# EAGLE design fdc (EAGLE 6.6.0)
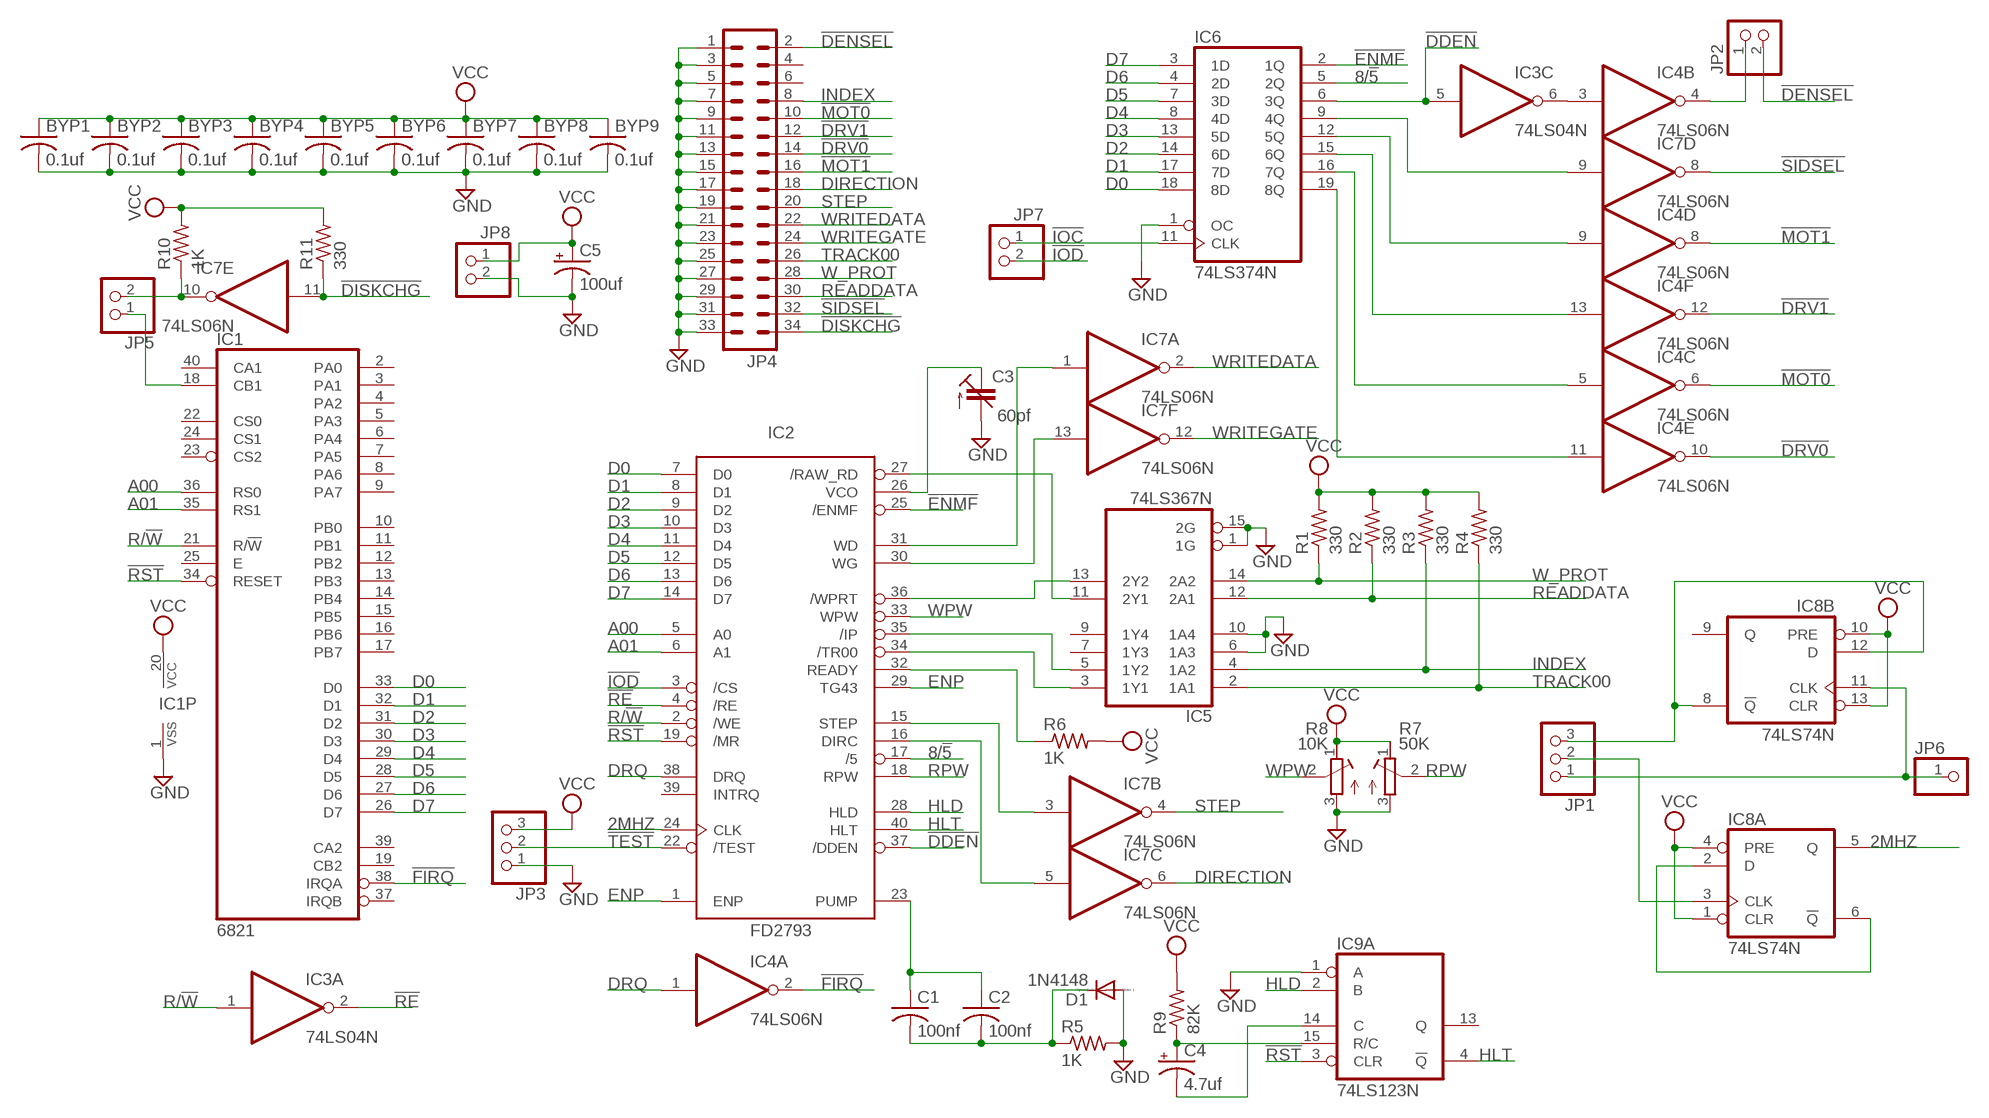
[diagram p0: schematic, sheet 1]

## Parts
BYP1  0.1uf  C-US050-025X075  [C050-025X075]
BYP2  0.1uf  C-US050-025X075  [C050-025X075]
BYP3  0.1uf  C-US050-025X075  [C050-025X075]
BYP4  0.1uf  C-US050-025X075  [C050-025X075]
BYP5  0.1uf  C-US050-025X075  [C050-025X075]
BYP6  0.1uf  C-US050-025X075  [C050-025X075]
BYP7  0.1uf  C-US050-025X075  [C050-025X075]
BYP8  0.1uf  C-US050-025X075  [C050-025X075]
BYP9  0.1uf  C-US050-025X075  [C050-025X075]
C1  100nf  C-US050-025X075  [C050-025X075]
C2  100nf  C-US050-025X075  [C050-025X075]
C3  60pf  C-TRIMM808  [CTRIM808-BC]
C4  4.7uf  CPOL-USE15-5AXIAL  [E15-5]
C5  100uf  CPOL-USE15-5AXIAL  [E15-5]
D1  1N4148  1N4148DO35-10  [DO35-10]
IC1  6821  [DIL40]
IC2  FD2793  [DIL40]
IC3  74LS04N  [DIL14]
IC4  74LS06N  [DIL14]
IC5  74LS367N  74367N  [DIL16]
IC6  74LS374N  [DIL20]
IC7  74LS06N  [DIL14]
IC8  74LS74N  [DIL14]
IC9  74LS123N  [DIL16]
JP1  PINHD-1X3  [1X03]
JP2  PINHD-1X2  [1X02]
JP3  PINHD-1X3  [1X03]
JP4  MA17-2  [MA17-2]
JP5  PINHD-1X2  [1X02]
JP6  PINHD-1X1  [1X01]
JP7  PINHD-1X2  [1X02]
JP8  PINHD-1X2  [1X02]
R1  330  R-US_0207/10  [0207/10]
R2  330  R-US_0207/10  [0207/10]
R3  330  R-US_0207/10  [0207/10]
R4  330  R-US_0207/10  [0207/10]
R5  1K  R-US_0207/10  [0207/10]
R6  1K  R-US_0207/10  [0207/10]
R7  50K  R-TRIMM43P  [RTRIM43P]
R8  10K  R-TRIMM43P  [RTRIM43P]
R9  82K  R-US_0207/10  [0207/10]
R10  1K  R-US_0207/10  [0207/10]
R11  330  R-US_0207/10  [0207/10]

## Nets
2MHZ: IC2.24(CLK) IC8.5(A:Q)
8/!5: IC2.17(/5) IC6.5(2Q)
!DDEN: IC2.37(/DDEN) IC3.5(C:I) IC6.6(3Q)
!DENSEL: JP2.2 JP4.2
!DISKCHG: IC7.11(E:I) JP4.34 R11.1
!DRV0: IC4.10(E:O) JP4.14
!DRV1: IC4.12(F:O) JP4.12
!ENMF: IC2.25(/ENMF) IC6.2(1Q)
!FIRQ: IC1.38(IRQA) IC4.2(A:O)
!IOC: IC6.11(CLK) JP7.1
!IOD: IC2.3(/CS) JP7.2
!MOT0: IC4.6(C:O) JP4.10
!MOT1: IC4.8(D:O) JP4.16
!RE: IC2.4(/RE) IC3.2(A:O)
!RST: IC1.34(RESET) IC2.19(/MR) IC9.3(A:CLR)
!SIDSEL: IC7.8(D:O) JP4.32
!TEST: IC2.22(/TEST) JP3.2
A00: IC1.36(RS0) IC2.5(A0)
A01: IC1.35(RS1) IC2.6(A1)
CB1: IC1.18(CB1) JP5.1
D0: IC1.33(D0) IC2.7(D0) IC6.18(8D)
D1: IC1.32(D1) IC2.8(D1) IC6.17(7D)
D2: IC1.31(D2) IC2.9(D2) IC6.14(6D)
D3: IC1.30(D3) IC2.10(D3) IC6.13(5D)
D4: IC1.29(D4) IC2.11(D4) IC6.8(4D)
D5: IC1.28(D5) IC2.12(D5) IC6.7(3D)
D6: IC1.27(D6) IC2.13(D6) IC6.4(2D)
D7: IC1.26(D7) IC2.14(D7) IC6.3(1D)
DIRECTION: IC7.6(C:O) JP4.18
DRQ: IC2.38(DRQ) IC4.1(A:I)
ENP: IC2.1(ENP) IC2.29(TG43)
GND: BYP1.2 BYP2.2 BYP3.2 BYP4.2 BYP5.2 BYP6.2 BYP7.2 BYP8.2 BYP9.2 C3.2(A) C5.- D1.A IC1.1(VSS) IC5.1(1G) IC5.6(1A3) IC5.10(1A4) IC5.15(2G) IC6.1(OC) IC9.1(A:A) JP3.1 JP4.1 JP4.3 JP4.5 JP4.7 JP4.9 JP4.11 JP4.13 JP4.15 JP4.17 JP4.19 JP4.21 JP4.23 JP4.25 JP4.27 JP4.29 JP4.31 JP4.33 JP8.2 R5.2 R7.3(A) R8.3(A)
HLD: IC2.28(HLD) IC9.2(A:B)
HLT: IC2.40(HLT) IC9.4(A:!Q)
INDEX: IC5.4(1A2) JP4.8 R3.1
N$1: IC3.6(C:O) IC4.3(B:I)
N$2: IC4.4(B:O) JP2.1
N$3: IC2.27(/RAW_RD) IC5.11(2Y1)
N$4: IC4.11(E:I) IC6.19(8Q)
N$5: IC4.5(C:I) IC6.16(7Q)
N$6: IC4.13(F:I) IC6.15(6Q)
N$7: IC4.9(D:I) IC6.12(5Q)
N$8: C4.+ IC9.15(A:R/C) R9.1
N$9: C4.- IC9.14(A:C)
N$10: IC2.32(READY) R6.1
N$11: IC6.9(4Q) IC7.9(D:I)
N$12: IC2.16(DIRC) IC7.5(C:I)
N$13: IC7.10(E:O) JP5.2 R10.1
N$14: IC2.34(/TR00) IC5.3(1Y1)
N$15: IC2.35(/IP) IC5.5(1Y2)
N$16: IC8.8(B:!Q) IC8.12(B:D) JP1.3
N$17: IC2.36(/WPRT) IC5.13(2Y2)
N$18: IC8.11(B:CLK) JP1.1 JP6.1
N$19: C3.1(E) IC2.26(VCO)
N$20: C1.2 C2.2 D1.C R5.1
N$21: IC2.31(WD) IC7.1(A:I)
N$22: IC2.30(WG) IC7.13(F:I)
N$24: IC2.15(STEP) IC7.3(B:I)
N$25: IC8.3(A:CLK) JP1.2
N$26: IC8.2(A:D) IC8.6(A:!Q)
PUMP: C1.1 C2.1 IC2.23(PUMP)
R/!W: IC1.21(R/!W) IC2.2(/WE) IC3.1(A:I)
READDATA: IC5.12(2A1) JP4.30 R2.1
RPW: IC2.18(RPW) R7.2(S)
STEP: IC7.4(B:O) JP4.20
TRACK00: IC5.2(1A1) JP4.26 R4.1
VCC [Power]: BYP1.1 BYP2.1 BYP3.1 BYP4.1 BYP5.1 BYP6.1 BYP7.1 BYP8.1 BYP9.1 C5.+ IC1.20(VCC) IC8.1(A:CLR) IC8.4(A:PRE) IC8.10(B:PRE) IC8.13(B:CLR) JP3.3 JP8.1 R1.2 R2.2 R3.2 R4.2 R6.2 R7.1(E) R8.1(E) R9.2 R10.2 R11.2
W_PROT: IC5.14(2A2) JP4.28 R1.1
WPW: IC2.33(WPW) R8.2(S)
WRITEDATA: IC7.2(A:O) JP4.22
WRITEGATE: IC7.12(F:O) JP4.24
Unconnected: IC1.2(PA0) IC1.3(PA1) IC1.4(PA2) IC1.5(PA3) IC1.6(PA4) IC1.7(PA5) IC1.8(PA6) IC1.9(PA7) IC1.10(PB0) IC1.11(PB1) IC1.12(PB2) IC1.13(PB3) IC1.14(PB4) IC1.15(PB5) IC1.16(PB6) IC1.17(PB7) IC1.19(CB2) IC1.22(CS0) IC1.23(CS2) IC1.24(CS1) IC1.25(E) IC1.37(IRQB) IC1.39(CA2) IC1.40(CA1) IC2.39(INTRQ) IC3.3(B:I) IC3.4(B:O) IC3.8(D:O) IC3.9(D:I) IC3.10(E:O) IC3.11(E:I) IC3.12(F:O) IC3.13(F:I) IC5.7(1Y3) IC5.9(1Y4) IC8.9(B:Q) IC9.5(B:Q) IC9.6(B:C) IC9.7(B:R/C) IC9.9(B:A) IC9.10(B:B) IC9.11(B:CLR) IC9.12(B:!Q) IC9.13(A:Q) JP4.4 JP4.6

## Power pins joined to a net without a drawn wire
GND: IC2.20(GND) IC3.7(P:GND) IC4.7(P:GND) IC5.8(GND) IC6.10(GND) IC7.7(P:GND) IC8.7(P:GND) IC9.8(P:GND)
VCC: IC2.21(VCC) IC3.14(P:VCC) IC4.14(P:VCC) IC5.16(VCC) IC6.20(VCC) IC7.14(P:VCC) IC8.14(P:VCC) IC9.16(P:VCC)

## Library data of the parts
BYP1-BYP9 C1 C2 = rcl:C-US: CAPACITOR, American symbol
C3 = rcl:C-TRIMM: Trimm capacitor
C4 C5 = rcl:CPOL-US: POLARIZED CAPACITOR, American symbol
D1 = diode:1N4148: DIODE high speed (Philips)
IC1 = micro-motorola:6821: MICROCONTROLLER/MEMORY DEVICE; MF: NTE ELECTRONICS; MPN: NTE6821; OC_FARNELL: 1652403; OC_NEWARK: 29C4772
IC2 = western-digital-devices:FD2793: FD2793 Floppy Disk Formatter/Controller
IC3 = 74xx-us:74*04: Hex INVERTER
IC4 IC7 = 74xx-us:74*06: Hex INVERTER, open collector high-voltage output
IC5 = 74xx-us:74*367: Hex BUS DRIVER, 3-state
IC6 = 74xx-us:74*374: Octal D type transparent LATCH, edge triggered
IC8 = 74xx-us:74*74: Dual D type positive edge triggered FLIP FLOP, preset and clear
IC9 = 74xx-us:74*123: Retriggerable monostable MULTIVIBRATOR
JP1 JP3 = pinhead:PINHD-1X3: PIN HEADER
JP2 JP5 JP7 JP8 = pinhead:PINHD-1X2: PIN HEADER
JP4 = con-lstb:MA17-2: PIN HEADER; OC_FARNELL: unknown; OC_NEWARK: unknown
JP6 = pinhead:PINHD-1X1: PIN HEADER
R1-R6 R9-R11 = rcl:R-US_: RESISTOR, American symbol
R7 R8 = rcl:R-TRIMM: Trimm resistor

## Net classes
1 Power: width 0.508 mm, drill 0.254 mm, clearance 0.254 mm

## Board
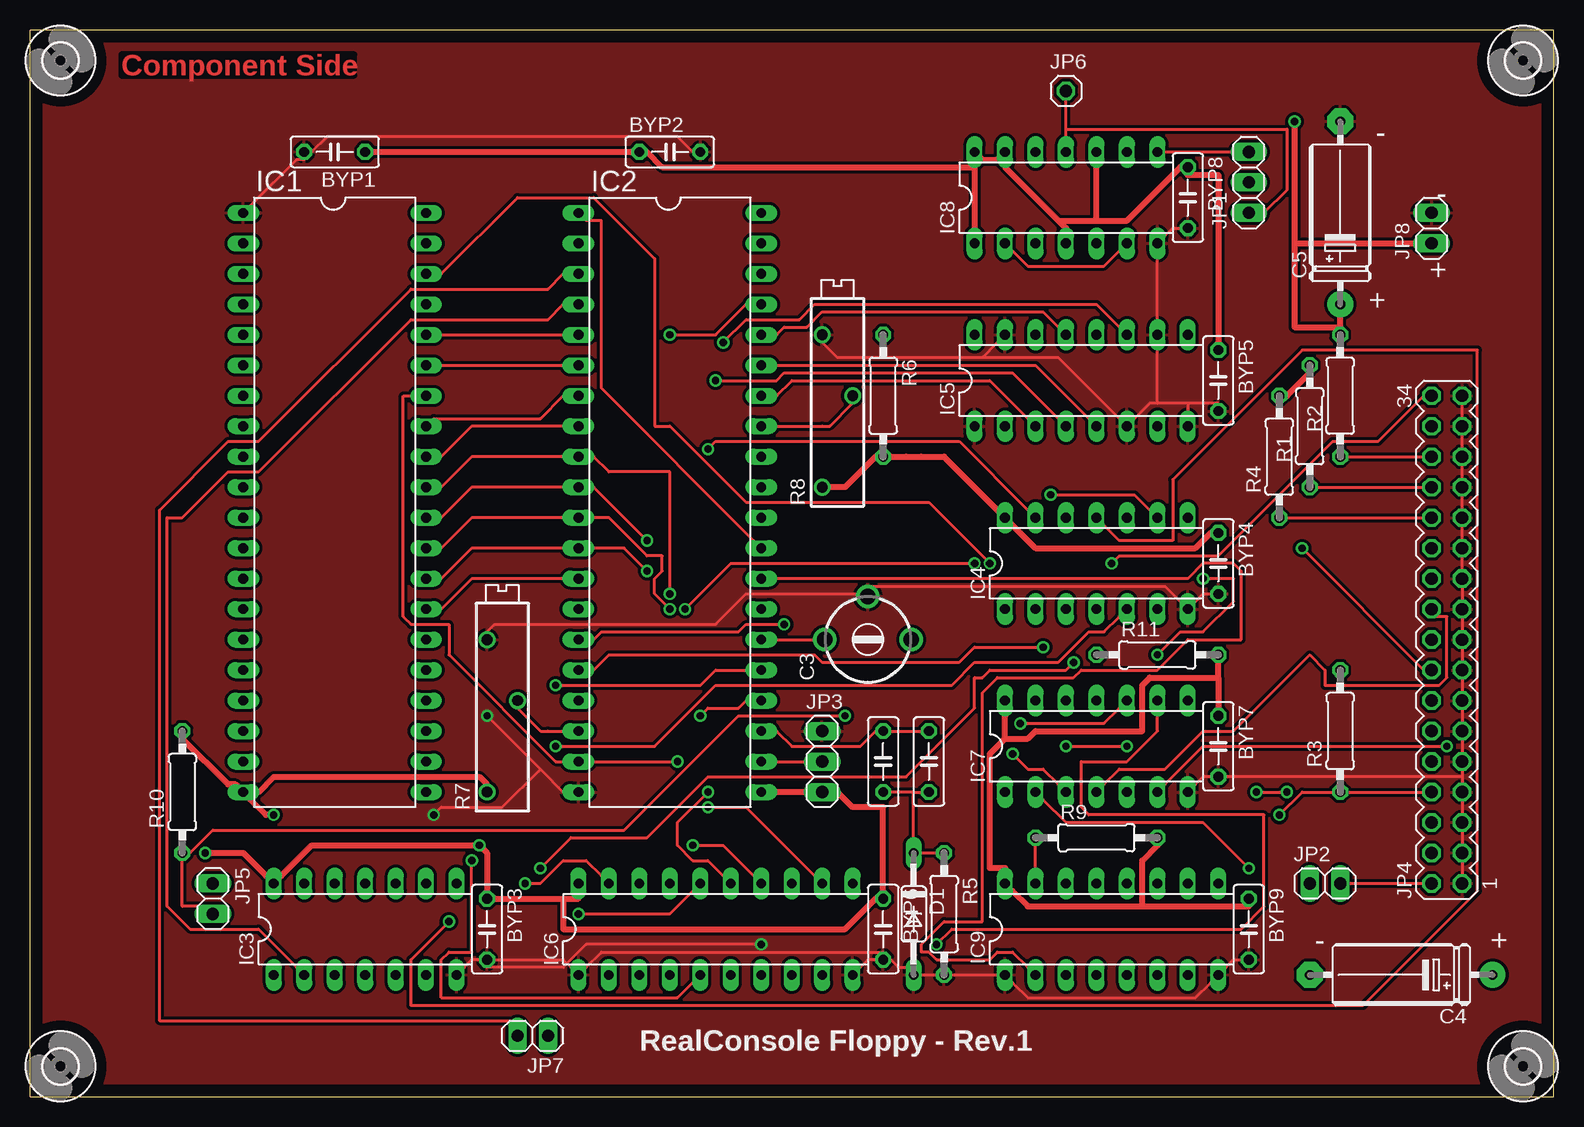
[diagram p1: board, top side]
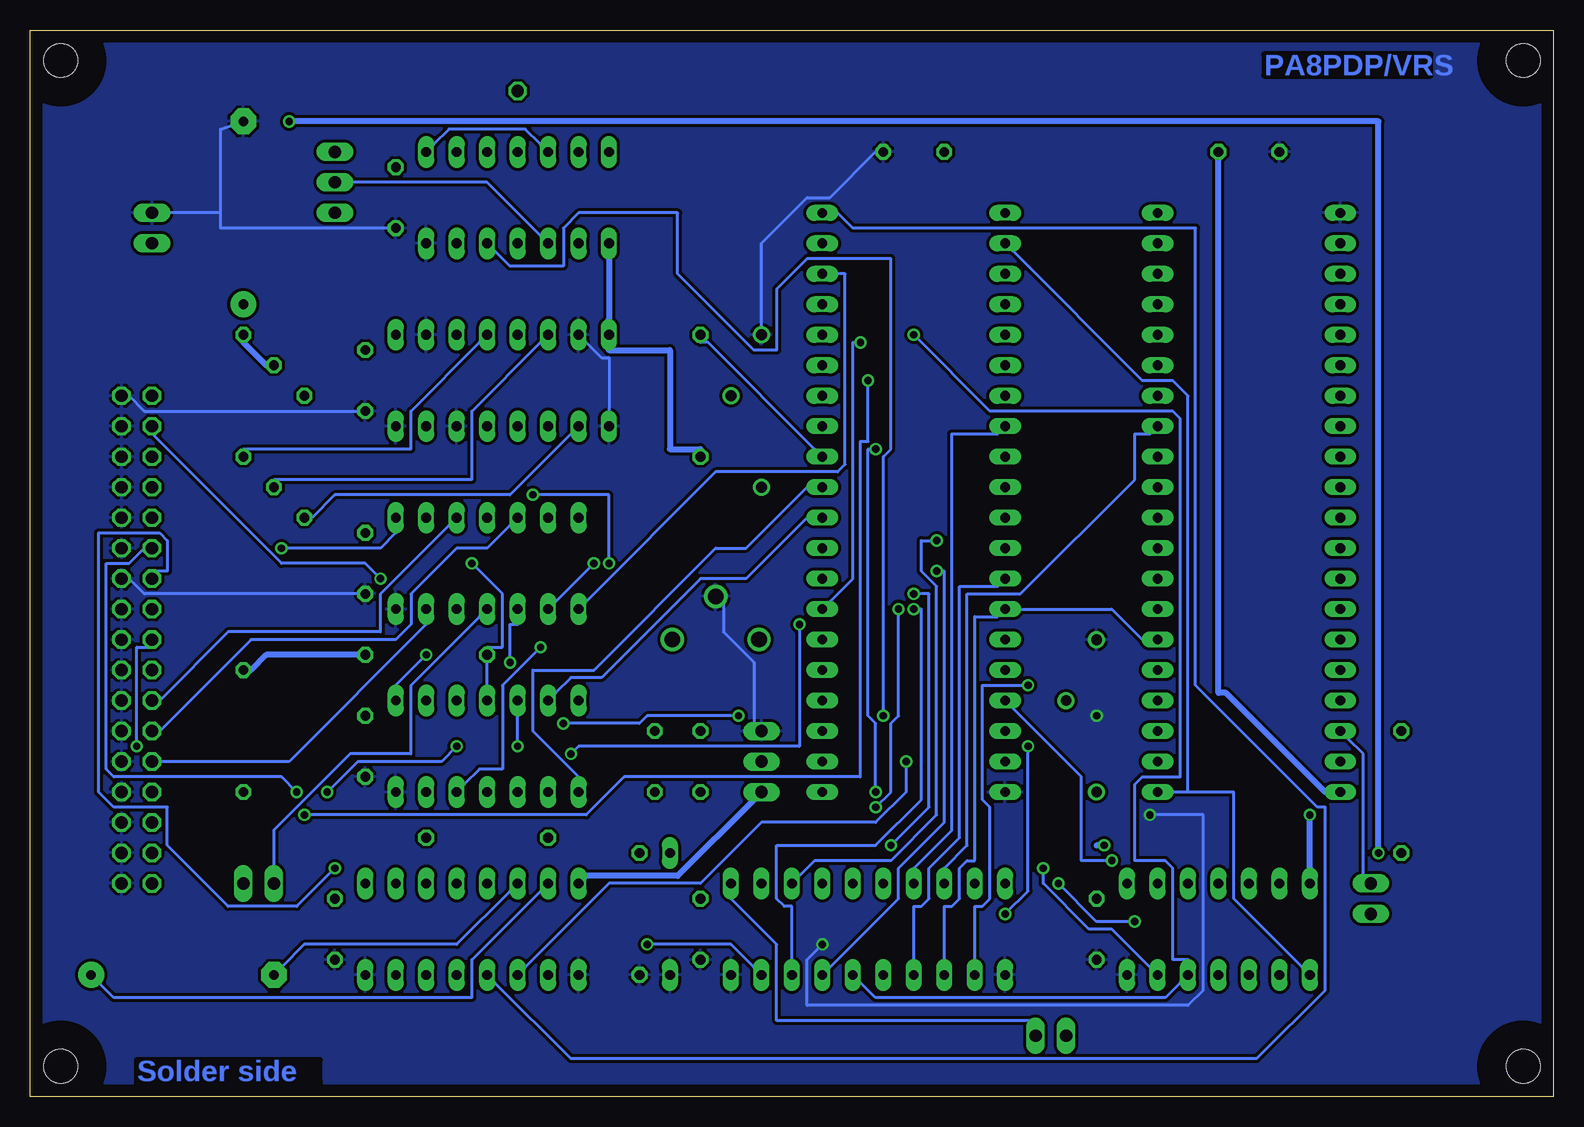
[diagram p2: board, bottom side, seen from below]

Size 127.01 x 88.9 mm. Coordinates in mm from the lower left corner, seen from the top.
Outline: 0,0 127.01,0.01
Outline: 0,0 0,88.9 127,88.9 127,0
Copper layers (1*16): Top 0.035mm / dielectric 1.5mm / Bottom 0.035mm
Design rules "olimex10mil": minimum track width 10mil, minimum drill 24mil, track to track 10mil, track to pad 10mil, pad to pad 10mil, via to via 10mil, smd to smd 10mil, copper to edge 40mil, drill to drill 10mil, minimum pad ring 10mil, minimum via ring 8mil, stop-mask expansion 0mil, vias tented up to drill 0mil, thermal gap 10mil

### Footprints (pad centres in the part's own frame; a part is rotated, then mirrored left to right if it is on the bottom)
C050-025X075 = drill 0.813 octagon: 1 -2.54,0; 2 2.54,0
CTRIM808-BC = drill 1.3: 1 -3.607,0; 2 0,3.607; 3 3.607,0
E15-5 = drill 0.813 pad 2.159: + -7.62,0 | drill 0.813 pad 2.159 octagon: - 7.62,0
DO35-10 = drill 0.813 long: A 5.08,0; C -5.08,0
DIL40 = drill 0.813 long: 1 -24.13,-7.62; 2 -21.59,-7.62; 3 -19.05,-7.62; 4 -16.51,-7.62; 5 -13.97,-7.62; 6 -11.43,-7.62; 7 -8.89,-7.62; 8 -6.35,-7.62; 9 -3.81,-7.62; 10 -1.27,-7.62; 11 1.27,-7.62; 12 3.81,-7.62; 13 6.35,-7.62; 14 8.89,-7.62; 15 11.43,-7.62; 16 13.97,-7.62; 17 16.51,-7.62; 18 19.05,-7.62; 19 21.59,-7.62; 20 24.13,-7.62; 21 24.13,7.62; 22 21.59,7.62; 23 19.05,7.62; 24 16.51,7.62; 25 13.97,7.62; 26 11.43,7.62; 27 8.89,7.62; 28 6.35,7.62; 29 3.81,7.62; 30 1.27,7.62; 31 -1.27,7.62; 32 -3.81,7.62; 33 -6.35,7.62; 34 -8.89,7.62; 35 -11.43,7.62; 36 -13.97,7.62; 37 -16.51,7.62; 38 -19.05,7.62; 39 -21.59,7.62; 40 -24.13,7.62
DIL14 = drill 0.813 long: 1 -7.62,-3.81; 2 -5.08,-3.81; 3 -2.54,-3.81; 4 0,-3.81; 5 2.54,-3.81; 6 5.08,-3.81; 7 7.62,-3.81; 8 7.62,3.81; 9 5.08,3.81; 10 2.54,3.81; 11 0,3.81; 12 -2.54,3.81; 13 -5.08,3.81; 14 -7.62,3.81
DIL16 = drill 0.813 long: 1 -8.89,-3.81; 2 -6.35,-3.81; 3 -3.81,-3.81; 4 -1.27,-3.81; 5 1.27,-3.81; 6 3.81,-3.81; 7 6.35,-3.81; 8 8.89,-3.81; 9 8.89,3.81; 10 6.35,3.81; 11 3.81,3.81; 12 1.27,3.81; 13 -1.27,3.81; 14 -3.81,3.81; 15 -6.35,3.81; 16 -8.89,3.81
DIL20 = drill 0.813 long: 1 -11.43,-3.81; 2 -8.89,-3.81; 3 -6.35,-3.81; 4 -3.81,-3.81; 5 -1.27,-3.81; 6 1.27,-3.81; 7 3.81,-3.81; 8 6.35,-3.81; 9 8.89,-3.81; 10 11.43,-3.81; 11 11.43,3.81; 12 8.89,3.81; 13 6.35,3.81; 14 3.81,3.81; 15 1.27,3.81; 16 -1.27,3.81; 17 -3.81,3.81; 18 -6.35,3.81; 19 -8.89,3.81; 20 -11.43,3.81
1X03 = drill 1.016 long: 1 -2.54,0; 2 0,0; 3 2.54,0
1X02 = drill 1.016 long: 1 -1.27,0; 2 1.27,0
MA17-2 = drill 1.016 octagon: 1 -20.32,-1.27; 2 -20.32,1.27; 3 -17.78,-1.27; 4 -17.78,1.27; 5 -15.24,-1.27; 6 -15.24,1.27; 7 -12.7,-1.27; 8 -12.7,1.27; 9 -10.16,-1.27; 10 -10.16,1.27; 11 -7.62,-1.27; 12 -7.62,1.27; 13 -5.08,-1.27; 14 -5.08,1.27; 15 -2.54,-1.27; 16 -2.54,1.27; 17 0,-1.27; 18 0,1.27; 19 2.54,-1.27; 20 2.54,1.27; 21 5.08,-1.27; 22 5.08,1.27; 23 7.62,-1.27; 24 7.62,1.27; 25 10.16,-1.27; 26 10.16,1.27; 27 12.7,-1.27; 28 12.7,1.27; 29 15.24,-1.27; 30 15.24,1.27; 31 17.78,-1.27; 32 17.78,1.27; 33 20.32,-1.27; 34 20.32,1.27
1X01 = drill 1.016 octagon: 1 0,0
0207/10 = drill 0.813 octagon: 1 -5.08,0; 2 5.08,0
RTRIM43P = drill 0.9: 1 -7.62,1.27; 2 0,-1.27; 3 5.08,1.27
2,8 = hole 2.8: 0,0

### Placement (x,y rotation side)
BYP1  25.4,78.74 180 top
BYP2  53.34,78.74 0 top
BYP3  38.1,13.97 270 top
BYP4  99.06,44.45 270 top
BYP5  99.06,59.69 270 top
BYP6  71.12,13.97 270 top
BYP7  99.06,29.21 270 top
BYP8  96.52,74.93 270 top
BYP9  101.6,13.97 270 top
C1  74.93,27.94 270 top
C2  71.12,27.94 270 top
C3  69.85,38.1 0 top
C4  114.3,10.16 180 top
C5  109.22,73.66 90 top
D1  73.66,15.24 270 top
IC1  25.4,49.53 270 top
IC2  53.34,49.53 270 top
IC3  27.94,13.97 0 top
IC4  88.9,44.45 0 top
IC5  87.63,59.69 0 top
IC6  57.15,13.97 0 top
IC7  88.9,29.21 0 top
IC8  86.36,74.93 0 top
IC9  90.17,13.97 0 top
JP1  101.6,76.2 90 top
JP2  107.95,17.78 0 top
JP3  66.04,27.94 270 top
JP4  118.11,38.1 90 top
JP5  15.24,16.51 270 top
JP6  86.36,83.82 0 top
JP7  41.91,5.08 180 top
JP8  116.84,72.39 90 top
R1  106.68,55.88 90 top
R2  109.22,58.42 90 top
R3  109.22,30.48 90 top
R4  104.14,53.34 90 top
R5  76.2,15.24 270 top
R6  71.12,58.42 270 top
R7  39.37,33.02 90 top
R8  67.31,58.42 90 top
R9  88.9,21.59 0 top
R10  12.7,25.4 90 top
R11  93.98,36.83 0 top
U$3  [2,8]  2.54,86.36 0 top
U$4  [2,8]  2.54,2.54 0 top
U$5  [2,8]  124.46,86.36 0 top
U$6  [2,8]  124.46,2.54 0 top

### Tracks (layer width: path | path; a pad name or v marks a point on that pad's centre or on a via)
2MHZ  (via drill 0.61)
  Top 0.254: v55.88,31.75 56.52,32.38 59.05,32.38 59.69,33.02 IC2.24
  Bottom 0.254: v55.88,31.75 55.88,53.34 55.24,53.98 55.24,69.85 62.23,69.85 64.77,67.31 64.77,62.23 66.67,62.23 73.03,68.58 73.03,73.66 81.28,73.66 82.55,72.39 82.55,69.22 87,69.22 88.27,70.48 IC8.5
8/!5  (via drill 0.61)
  Top 0.254: v36.83,19.68 36.83,12.06 34.92,12.06 34.29,11.43 34.29,8.26 53.98,8.26 55.24,9.53 IC6.5
  Bottom 0.254: v36.83,19.68 39.37,19.68 39.37,26.67 45.09,32.38 IC2.17
!DDEN  (via drill 0.61)
  Top 0.254: v53.34,63.5 57.15,63.5 59.69,66.04 IC2.37
  Bottom 0.254: IC6.6 57.78,9.53 56.52,8.26 32.38,8.26 31.11,9.53 IC3.5 30.48,11.43 31.75,11.43 31.75,19.05 32.38,19.68 34.92,19.68 34.92,26.04 34.29,26.67 31.11,26.67 31.11,56.52 31.75,57.15 46.99,57.15 v53.34,63.5
!DENSEL
  Top 0.254: JP2.2 109.86,17.78 116.2,17.78 JP4.2
!DISKCHG  (via drill 0.61)
  Top 0.254: v90.17,44.45 90.81,45.09 99.06,45.09 108.58,54.61 112.39,54.61 116.2,58.42 JP4.34
  Bottom 0.254: IC7.11 88.9,34.29 88.9,36.2 R11.1 88.9,37.47 87.63,37.47 87.63,41.91 v90.17,44.45
!DRV0
  Bottom 0.254: IC4.10 92.08,47.62 97.79,41.91 97.79,38.73 110.49,38.73 116.2,33.02 JP4.14
!DRV1
  Bottom 0.254: IC4.12 87,47.62 88.9,45.72 91.44,45.72 95.25,41.91 95.25,39.37 96.52,38.1 108.58,38.1 116.2,30.48 JP4.12
!ENMF  (via drill 0.61)
  Top 0.254: v43.81,34.29 55.88,34.29 57.15,35.56 59.69,35.56 IC2.25
  Bottom 0.254: v43.81,34.29 47.62,34.29 47.62,24.77 46.99,24.13 46.99,16.51 47.62,15.88 48.26,15.88 48.26,11.43 IC6.2
!FIRQ  (via drill 0.61)
  Top 0.254: v80.01,44.45 74.93,49.53 59.69,49.53 53.34,55.88 52.07,55.88 52.07,69.85 46.99,74.93 40.64,74.93 34.29,68.58 IC1.38
  Bottom 0.254: v80.01,44.45 83.19,41.27 IC4.2
!IOC
  Bottom 0.254: IC6.11 68.58,16.51 64.77,12.7 64.77,6.35 43.18,6.35 JP7.1
!IOD
  Top 0.254: IC2.3 44.45,68.58 43.18,67.31 31.75,67.31 19.05,54.61 16.51,54.61 10.79,48.9 10.79,6.35 40.64,6.35 JP7.2
!MOT0
  Bottom 0.254: IC4.6 93.98,39.37 105.41,27.94 116.2,27.94 JP4.10
!MOT1  (via drill 0.61)
  Top 0.254: v106.05,45.72 116.2,35.56 JP4.16
  Bottom 0.254: v106.05,45.72 97.79,45.72 96.52,46.99 IC4.8
!RE
  Top 0.254: IC3.2 22.23,10.79 19.05,13.97 13.34,13.97 11.43,15.88 11.43,48.26 12.7,48.26 16.51,52.07 19.05,52.07 31.75,64.77 43.18,64.77 44.45,66.04 IC2.4
!RST  (via drill 0.61)
  Top 0.254: IC1.34 31.75,58.42 31.11,58.42 31.11,40.01 31.75,39.37 34.92,39.37 34.92,36.83 43.81,27.94 44.45,27.94 IC2.19 46.99,27.94 v53.98,27.94
  Bottom 0.254: v53.98,27.94 53.98,25.4 56.52,22.86 66.04,22.86 71.12,17.78 78.74,17.78 85.72,10.79 IC9.3
!SIDSEL  (via drill 0.61)
  Top 0.254: v93.98,36.83 95.89,38.73 97.79,38.73 100.33,41.27 100.33,43.18 v97.79,43.18
  Bottom 0.254: v93.98,36.83 96.52,34.29 IC7.8 | v97.79,43.18 99.06,44.45 106.05,44.45 116.84,55.24 JP4.32
!TEST
  Top 0.254: IC2.22 62.23,27.94 64.77,27.94 JP3.2
A00
  Top 0.254: IC1.36 34.29,63.5 44.45,63.5 IC2.5
A01
  Top 0.254: IC1.35 34.29,60.96 44.45,60.96 IC2.6
CB1
  Bottom 0.254: IC1.18 17.14,29.84 15.88,28.57 15.88,18.41 JP5.1
D0
  Top 0.254: IC2.7 44.45,58.42 42.55,56.52 33.66,56.52 IC1.33
  Bottom 0.254: IC6.18 50.8,19.05 48.9,20.95 48.9,41.91 44.45,41.91 34.92,51.44 34.92,55.24 33.66,55.24 IC1.33
D1
  Top 0.254: IC1.32 34.29,53.34 36.83,55.88 44.45,55.88 IC2.8
  Bottom 0.254: IC6.17 53.34,19.05 50.16,22.23 50.16,55.24 46.35,55.24 IC2.8
D2  (via drill 0.61)
  Top 0.254: v55.24,20.95 57.78,20.95 60.33,18.41 IC6.14 | v53.34,41.91 53.34,52.07 48.26,52.07 46.99,53.34 IC2.9 44.45,53.34 36.83,53.34 34.29,50.8 IC1.31
  Bottom 0.254: v55.24,20.95 52.07,24.13 52.07,41.91 v53.34,41.91
D3  (via drill 0.61)
  Top 0.254: v51.44,46.35 46.99,50.8 IC2.10 44.45,50.8 36.83,50.8 34.29,48.26 IC1.30
  Bottom 0.254: v51.44,46.35 52.7,46.35 52.7,43.81 51.44,42.55 51.44,23.5 55.24,19.68 61.59,19.68 62.87,18.41 IC6.13
D4  (via drill 0.61)
  Top 0.254: v53.34,40.64 52.07,41.91 52.07,43.18 52.7,43.81 52.7,45.09 51.44,45.09 48.26,48.26 46.99,48.26 IC2.11 44.45,48.26 36.83,48.26 34.29,45.72 IC1.29
  Bottom 0.254: v53.34,40.64 52.7,40.64 52.7,24.77 56.52,20.95 64.77,20.95 64.77,16.51 64.14,15.88 63.5,15.88 63.5,11.43 IC6.8
D5  (via drill 0.61)
  Top 0.254: v51.44,43.81 49.53,45.72 46.99,45.72 IC2.12 44.45,45.72 36.83,45.72 34.29,43.18 IC1.28
  Bottom 0.254: v51.44,43.81 50.8,43.81 50.8,22.86 54.61,19.05 54.61,16.51 60.33,10.79 IC6.7
D6
  Top 0.254: IC1.27 34.29,40.64 36.83,43.18 44.45,43.18 IC2.13
  Bottom 0.254: IC6.4 53.34,11.43 53.34,15.88 52.7,15.88 52.07,16.51 52.07,19.05 49.53,21.59 49.53,42.55 46.35,42.55 IC2.13
D7
  Bottom 0.254: IC6.3 50.8,11.43 50.8,15.88 50.16,15.88 49.53,16.51 49.53,19.05 48.9,19.68 48.26,19.68 48.26,40.01 46.35,40.01 IC2.14 44.45,40.64 36.83,40.64 34.29,38.1 IC1.26
DIRECTION  (via drill 0.61)
  Top 0.254: v118.11,29.21 97.79,29.21 94.61,26.04 IC7.6
  Bottom 0.254: v118.11,29.21 118.11,37.47 116.84,37.47 JP4.18
DRQ
  Bottom 0.254: IC4.1 80.64,41.27 69.85,52.07 59.69,52.07 59.05,52.7 59.05,68.58 59.69,68.58 IC2.38
ENP
  Top 0.254: IC2.29 60.33,46.35 47.62,59.05 47.62,73.03 46.35,73.03 IC2.1
GND  (via drill 0.61)
  Top 0.254: BYP8.2 95.89,72.39 95.25,72.39 94.61,71.75 IC8.7 93.98,69.85 93.98,64.77 IC5.10 93.98,62.23 93.98,57.78 | 96.52,57.78 99.06,57.78 BYP5.2 | 96.52,57.78 93.98,57.78 | 93.98,57.78 93.34,57.78 92.08,56.52 IC5.6 90.81,56.52 85.72,61.59 79.38,61.59 | 96.52,57.78 96.52,57.15 IC5.8 | IC1.1 18.41,74.3 22.23,78.11 22.86,78.11 BYP1.2 23.5,78.74 24.77,80.01 53.98,80.01 55.24,78.74 BYP2.2 | 79.38,61.59 67.94,61.59 67.31,61.59 66.04,62.87 R8.3 | 79.38,61.59 80.64,62.87 IC5.15 | BYP4.2 98.42,41.91 97.79,41.91 97.16,41.27 IC4.7 95.89,41.27 94.61,42.55 69.85,42.55 C3.2 69.22,41.91 59.69,41.91 57.15,39.37 39.37,39.37 38.73,39.37 38.1,38.73 R7.3 | 42.55,27.3 v38.1,31.75 | 42.55,27.3 44.45,25.4 IC2.20 | IC7.7 97.16,26.04 97.79,26.67 98.42,26.67 BYP7.2 99.69,26.67 119.38,26.67 | JP4.1 119.38,18.41 119.38,19.68 JP4.3 119.38,20.95 119.38,22.23 JP4.5 119.38,23.5 119.38,24.77 JP4.7 119.38,26.04 119.38,26.67 | 119.38,26.67 119.38,27.3 JP4.9 119.38,28.57 119.38,29.84 JP4.11 119.38,31.11 119.38,32.38 JP4.13 119.38,33.66 119.38,34.92 JP4.15 119.38,36.2 119.38,37.47 JP4.17 119.38,38.73 119.38,40.01 JP4.19 119.38,41.27 119.38,42.55 JP4.21 119.38,43.81 119.38,45.09 JP4.23 119.38,46.35 119.38,47.62 JP4.25 119.38,48.9 119.38,50.16 JP4.27 119.38,51.44 119.38,52.7 JP4.29 119.38,53.98 119.38,55.24 JP4.31 119.38,56.52 119.38,57.78 JP4.33 | IC3.7 36.2,10.79 36.83,11.43 37.47,11.43 BYP3.2 | BYP3.2 38.73,11.43 44.45,11.43 45.09,10.79 IC6.1 46.35,10.79 47.62,12.06 71.12,12.06 BYP6.2 | BYP9.2 100.97,11.43 100.33,11.43 99.69,10.79 IC9.8 98.42,9.53 97.16,8.26 83.19,8.26 81.92,9.53 IC9.1 80.64,10.16 76.83,10.16 R5.2 75.56,10.16 74.3,10.16 D1.A 73.03,10.79 72.39,10.79 71.75,11.43 BYP6.2
  Top 0.254: IC6.10 69.22,10.79 69.85,11.43 70.48,11.43 BYP6.2 | v60.96,12.7 46.35,12.7 44.45,10.79 38.1,10.79 BYP3.2 | v33.66,23.5 34.29,24.13 39.37,24.13 42.55,27.3
  Bottom 0.254: BYP2.2 56.52,78.74 60.33,74.93 62.23,74.93 66.04,71.12 66.04,64.14 R8.3 | IC5.1 78.74,57.15 78.74,61.59 79.38,61.59 80.64,62.87 IC5.15 | JP3.1 66.67,31.11 66.67,36.2 69.22,38.73 69.22,41.27 C3.2 | BYP4.2 99.69,41.91 117.47,41.91 118.75,43.18 JP4.21 | BYP5.2 99.69,57.15 117.47,57.15 118.75,58.42 JP4.33 | v60.96,12.7 62.23,11.43 62.23,7.62 30.48,7.62 29.21,8.89 29.21,23.5 v33.66,23.5 | 111.12,73.66 111.12,72.39 97.16,72.39 BYP8.2 | 111.12,73.66 111.12,80.64 C5.- | 111.12,73.66 115.57,73.66 JP8.2
  pour Bottom (isolate 0.254): 0,0 0,88.9 127,88.9 127,0
  pour Top (isolate 0.254): 0,0 0,88.9 127,88.9 127,0
HLD
  Top 0.254: IC2.28 62.23,43.18 96.52,43.18 97.79,44.45 100.33,44.45 100.97,43.81 100.97,38.1 96.52,38.1 93.98,35.56 87.63,35.56 87,34.92 80.64,34.92 79.38,33.66 79.38,14.61 76.2,14.61 74.3,12.7 74.3,12.06 74.93,12.06 75.56,11.43 80.01,11.43 80.64,12.06 81.92,12.06 83.19,10.79 IC9.2
HLT
  Bottom 0.254: IC9.4 88.27,9.53 81.92,3.17 24.77,3.17 19.05,8.89 19.05,24.13 19.68,24.13 29.84,34.29 29.84,72.39 58.42,72.39 59.69,73.66 IC2.40
INDEX  (via drill 0.61)
  Top 0.254: v57.15,59.69 62.23,59.69 62.87,60.33 81.92,60.33 85.72,56.52 IC5.4 | v104.14,23.5 106.05,25.4 108.58,25.4 R3.1 109.86,25.4 116.2,25.4 JP4.8
  Bottom 0.254: v57.15,59.69 57.15,54.61 57.78,54.61 57.78,26.67 77.47,26.67 80.64,23.5 v104.14,23.5
N$1  (via drill 0.61)
  Top 0.254: v42.55,19.05 45.09,21.59 51.44,21.59 56.52,26.67 73.03,26.67 78.74,32.38 78.74,34.92 79.38,34.92 80.01,35.56 86.36,35.56 v87,36.2
  Bottom 0.254: v42.55,19.05 42.55,17.78 38.73,13.97 36.83,13.97 33.66,10.79 IC3.6 | v87,36.2 87,39.37 86.36,39.37 IC4.3
N$2
  Bottom 0.254: IC4.4 89.53,40.01 95.25,34.29 95.25,28.57 100.33,28.57 106.68,22.23 106.68,19.05 JP2.1
N$3  (via drill 0.61)
  Top 0.254: v57.78,62.87 59.69,64.77 64.14,64.77 65.41,66.04 88.9,66.04 90.81,64.14 IC5.11
  Bottom 0.254: v57.78,62.87 58.42,62.87 58.42,43.18 60.33,41.27 IC2.27
N$4  (via drill 0.61)
  Top 0.254: v41.27,17.78 42.55,17.78 44.45,19.68 46.35,19.68 47.62,18.41 IC6.19 | v34.92,14.61 31.75,11.43 31.75,7.62 111.12,7.62 120.65,17.14 120.65,62.23 106.05,62.23 95.25,51.44 95.25,46.35 90.81,46.35 89.53,47.62 IC4.11
  Bottom 0.254: v41.27,17.78 38.1,14.61 v34.92,14.61
N$5  (via drill 0.61)
  Top 0.254: v45.72,15.24 53.34,15.24 55.24,17.14 IC6.16 | v43.81,29.21 52.07,29.21 57.15,34.29 76.83,34.29 78.74,36.2 85.72,36.2 88.27,38.73 89.53,38.73 90.81,40.01 IC4.5
  Bottom 0.254: v45.72,15.24 43.81,17.14 v43.81,29.21
N$6  (via drill 0.61)
  Top 0.254: v56.52,25.4 53.98,22.86 53.98,20.95 55.24,19.68 56.52,19.68 57.78,18.41 IC6.15 | v56.52,53.98 57.15,54.61 77.47,54.61 83.19,48.9 IC4.13
  Bottom 0.254: v56.52,25.4 56.52,31.11 57.15,31.75 57.15,53.98 v56.52,53.98
N$7  (via drill 0.61)
  Top 0.254: v56.52,24.13 59.69,24.13 65.41,18.41 IC6.12 | v54.61,40.64 58.42,44.45 v78.74,44.45 | v85.09,50.16 92.08,50.16 93.34,48.9 IC4.9
  Bottom 0.254: v56.52,24.13 55.24,25.4 55.24,31.11 54.61,31.75 v54.61,40.64 | v78.74,44.45 78.74,50.16 v85.09,50.16
N$8
  Top 0.254: R9.1 83.82,20.95 83.82,19.05 IC9.15
  Bottom 0.254: IC9.15 84.45,17.14 90.17,11.43 90.17,8.26 120.02,8.26 121.28,9.53 C4.+
N$9
  Bottom 0.254: IC9.14 87,17.14 91.44,12.7 104.14,12.7 106.05,10.79 C4.-
N$10
  Bottom 0.254: IC2.32 61.59,53.98 70.48,62.87 71.12,62.87 R6.1
N$11  (via drill 0.61)
  Top 0.254: v75.56,12.7 76.83,13.97 100.97,13.97 102.87,15.88 102.87,23.5 88.27,23.5 87.63,24.13 87.63,27.94 91.44,27.94 93.98,30.48 93.98,31.75 IC7.9
  Bottom 0.254: v75.56,12.7 68.58,12.7 66.67,10.79 IC6.9
N$12  (via drill 0.61)
  Top 0.254: v84.45,37.47 78.74,37.47 77.47,36.2 66.04,36.2 65.41,36.83 48.26,36.83 46.99,35.56 IC2.16
  Bottom 0.254: v84.45,37.47 87.63,34.29 87.63,27.3 89.53,27.3 90.81,26.04 IC7.5
N$13  (via drill 0.61)
  Top 0.254: JP5.2 14.61,15.88 12.7,15.88 12.7,19.68 R10.1 13.34,20.32 15.24,22.23 49.53,22.23 59.05,31.75 v67.94,31.75 | v82.55,31.11 89.53,31.11 90.81,32.38 IC7.10
  Bottom 0.254: v82.55,31.11 76.2,31.11 75.56,31.75 v67.94,31.75
N$14
  Top 0.254: IC2.34 62.23,58.42 63.5,59.69 80.01,59.69 83.19,56.52 IC5.3
N$15
  Top 0.254: IC2.35 62.23,60.96 83.82,60.96 88.27,56.52 IC5.5
N$16
  Top 0.254: JP1.3 100.33,78.74 94.61,78.74 IC8.8
  Bottom 0.254: IC8.12 84.45,79.38 85.72,80.64 92.08,80.64 93.34,79.38 IC8.8
N$17
  Top 0.254: IC2.36 62.23,63.5 62.87,64.14 64.77,64.14 66.04,65.41 84.45,65.41 85.72,64.14 IC5.13
N$18
  Top 0.254: 86.36,80.64 86.36,83.19 JP6.1 | 86.36,80.64 86.36,80.01 IC8.11 | 86.36,80.64 104.78,80.64 104.78,75.56 102.87,73.66 JP1.1
N$19
  Top 0.254: IC2.26 62.23,38.1 65.41,38.1 C3.1
N$20
  Top 0.254: R5.1 75.56,20.32 74.3,20.32 D1.C 73.66,21.59 73.66,25.4 | 73.66,25.4 74.3,25.4 C1.2 | 73.66,25.4 71.75,25.4 C2.2
N$21
  Bottom 0.254: IC7.1 81.28,26.67 85.09,30.48 85.09,35.56 80.01,35.56 69.85,45.72 67.31,45.72 62.23,50.8 IC2.31
N$22
  Bottom 0.254: IC2.30 62.23,48.26 67.31,43.18 71.12,43.18 79.38,34.92 81.92,34.92 83.19,33.66 IC7.13
N$24  (via drill 0.61)
  Top 0.254: v62.87,39.37 59.69,39.37 59.05,38.73 47.62,38.73 46.99,38.1 IC2.15 | v81.92,28.57 83.19,27.3 84.45,27.3 85.72,26.04 IC7.3
  Bottom 0.254: v62.87,39.37 62.87,29.21 81.28,29.21 v81.92,28.57
N$25
  Bottom 0.254: IC8.3 84.45,71.75 88.9,76.2 100.33,76.2 JP1.2
N$26
  Top 0.254: IC8.2 81.92,70.48 83.19,69.22 89.53,69.22 90.81,70.48 IC8.6
PUMP
  Top 0.254: IC2.23 62.23,30.48 63.5,29.21 69.22,29.21 70.48,30.48 C2.1 71.75,30.48 74.3,30.48 C1.1
R/!W
  Bottom 0.254: 30.48,25.4 31.75,25.4 IC1.21 | 30.48,25.4 26.67,25.4 26.67,16.51 20.95,10.79 IC3.1 | 30.48,25.4 30.48,58.42 31.75,59.69 34.29,59.69 45.09,70.48 IC2.2
READDATA
  Top 0.254: JP4.30 116.2,53.34 109.86,53.34 R2.1
  Bottom 0.254: IC5.12 89.53,62.87 95.25,57.15 95.25,53.98 109.22,53.98 R2.1
RPW
  Top 0.254: IC2.18 44.45,30.48 43.18,30.48 42.55,30.48 40.64,32.38 R7.2
STEP
  Top 0.254: IC7.4 89.53,26.04 90.81,27.3 94.61,27.3 97.79,30.48 100.33,30.48 106.68,36.83 107.95,35.56 107.95,34.29 117.47,34.29 118.11,34.92 118.11,40.01 116.84,40.01 JP4.20
TRACK00
  Top 0.254: JP4.26 116.2,48.26 104.78,48.26 R4.1
  Bottom 0.254: IC5.2 81.92,55.24 87,50.16 101.6,50.16 103.5,48.26 R4.1
VCC  (via drill 0.61)
  Top 0.508: R6.2 70.48,53.34 | R6.2 71.75,53.34 73.03,53.34 74.3,53.34 76.2,53.34 80.64,48.9 IC4.14 81.92,47.62 83.82,45.72 97.16,45.72 98.42,46.99 BYP4.1 | BYP1.1 28.57,78.74 50.16,78.74 BYP2.1 51.44,78.74 52.7,77.47 78.74,77.47 | 85.72,73.03 81.28,77.47 IC8.13 80.64,78.11 79.38,78.11 IC8.14 | 85.72,73.03 86.36,72.39 IC8.4 | 85.72,73.03 88.9,73.03 | 88.9,73.03 91.44,73.03 95.89,77.47 BYP8.1 96.52,76.83 99.06,76.83 99.06,62.87 BYP5.1 | 88.9,73.03 88.9,77.47 IC8.10 | 78.74,77.47 78.74,72.39 IC8.1 | 78.74,77.47 IC8.14 | 78.74,77.47 IC8.14 | IC1.20 19.05,25.4 20.32,26.67 36.83,26.67 37.47,26.67 38.1,26.04 R7.1 | R10.2 12.7,29.84 16.51,26.04 17.14,26.04 IC1.20 | 44.45,16.51 45.72,16.51 IC6.20 | 44.45,16.51 38.73,16.51 BYP3.1 38.1,17.14 38.1,20.32 v37.47,20.95 23.5,20.95 20.95,18.41 IC3.14 19.68,18.41 17.78,20.32 v14.61,20.32 | IC2.21 62.23,25.4 64.77,25.4 JP3.3 67.31,25.4 68.58,24.13 71.12,24.13 71.12,17.14 BYP6.1 70.48,16.51 67.94,13.97 44.45,13.97 44.45,16.51 | 99.06,34.92 99.06,36.2 R11.2 | 99.06,34.92 99.06,32.38 BYP7.1 | 92.71,15.88 83.19,15.88 81.92,17.14 IC9.16 81.28,19.05 80.01,19.05 80.01,28.57 81.28,29.84 | 92.71,15.88 101.6,15.88 BYP9.1 | 81.28,29.84 81.28,31.75 IC7.14 | 99.06,34.92 93.34,34.92 92.71,34.29 92.71,30.48 83.82,30.48 83.19,29.84 81.28,29.84 | 70.48,53.34 67.94,50.8 66.67,50.8 R8.1 | R6.2 70.48,53.34 | v20.32,23.5 19.68,23.5 18.41,24.77 IC1.20 | R4.2 104.78,58.42 106.68,60.33 R1.2 | v105.41,81.28 105.41,71.12 | 105.41,71.12 105.41,64.14 109.22,64.14 | 109.22,64.14 R2.2 | 109.22,64.14 R2.2 | 105.41,71.12 115.57,71.12 JP8.1 | 109.22,64.14 109.22,65.41 C5.+ | 109.22,64.14 R2.2
  Top 0.508: 92.71,15.88 92.71,19.68 93.98,20.95 R9.2
  Bottom 0.508: IC8.1 78.74,69.85 78.74,64.77 IC5.16 78.74,62.23 73.66,62.23 73.66,53.98 71.12,53.98 R6.2 | JP3.3 66.67,24.77 73.03,18.41 80.64,18.41 IC9.16 | v37.47,20.95 38.1,20.95 | BYP1.1 27.94,78.11 27.94,33.66 27.3,33.66 19.05,25.4 IC1.20 | v20.32,23.5 20.32,19.05 IC3.14 | R3.2 108.58,35.56 107.31,36.83 99.69,36.83 R11.2 | R2.2 109.22,62.87 107.31,60.96 R1.2 | v14.61,20.32 14.61,81.28 v105.41,81.28
W_PROT
  Top 0.254: JP4.28 116.2,50.8 107.31,50.8 R1.1
  Bottom 0.254: IC5.14 84.45,62.87 90.17,57.15 90.17,51.44 106.68,51.44 R1.1
WPW
  Top 0.254: IC2.33 62.23,55.88 66.04,55.88 66.67,55.88 68.58,57.78 R8.2
WRITEDATA  (via drill 0.61)
  Top 0.254: v101.6,19.05 97.79,22.86 86.36,22.86 84.45,24.77 IC7.2
  Bottom 0.254: v101.6,19.05 104.78,15.88 110.49,15.88 115.57,20.95 115.57,24.13 120.02,24.13 121.28,25.4 121.28,46.99 116.2,46.99 115.57,46.35 115.57,43.81 116.84,43.81 JP4.22
WRITEGATE  (via drill 0.61)
  Top 0.254: v86.36,29.21 v91.44,29.21 | v102.23,25.4 v104.78,25.4
  Bottom 0.254: v86.36,29.21 86.36,31.75 IC7.12 | v91.44,29.21 92.71,27.94 99.69,27.94 v102.23,25.4 | v104.78,25.4 106.05,26.67 120.02,26.67 120.65,27.3 120.65,44.45 118.75,44.45 117.47,45.72 JP4.24

### Text on the board
Top: Component Side
Bottom: PA8PDP/VRS | Solder side
tPlace: - | - | + | + | - | + | RealConsole Floppy - Rev.1